# EAGLE schematic ME433 (EAGLE 7.5.0)
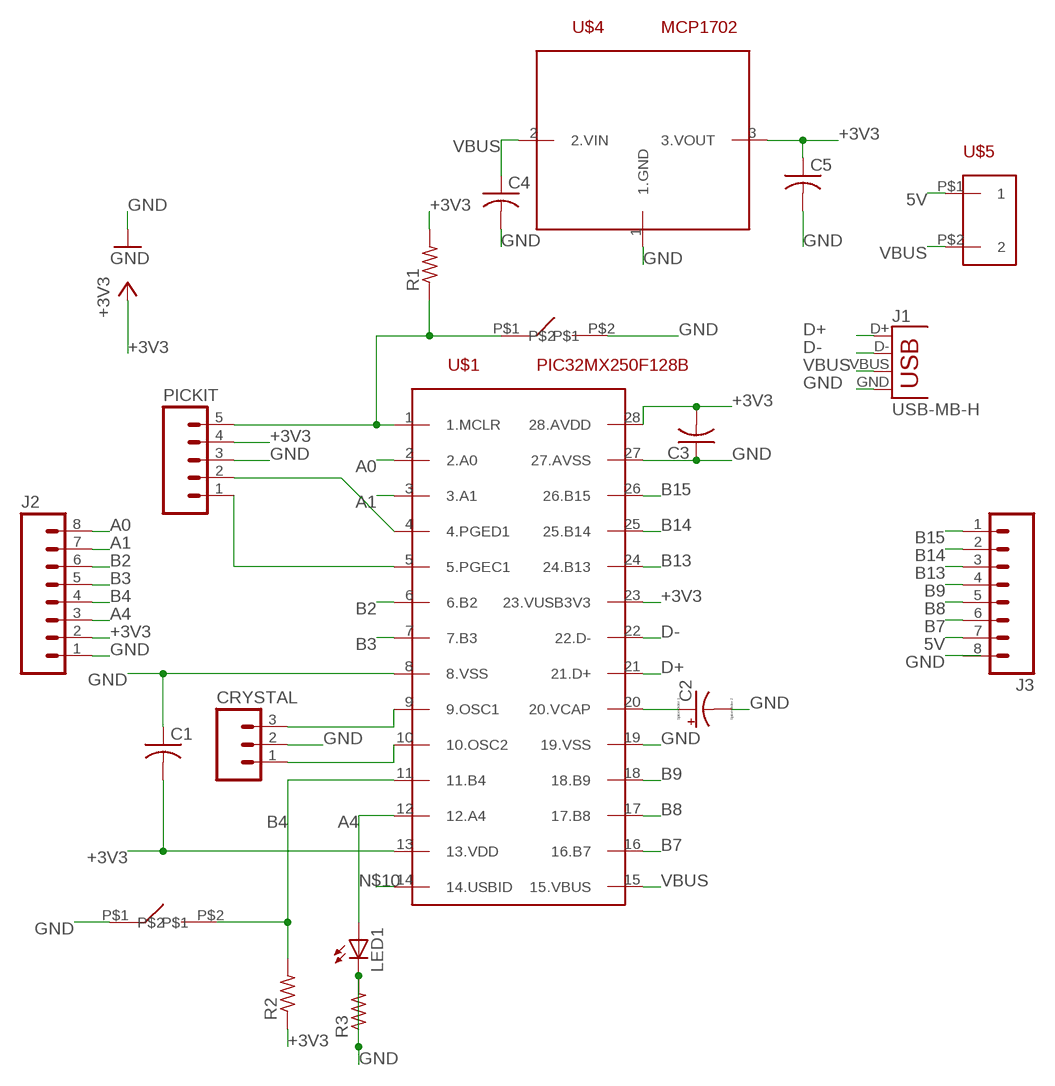
[diagram p0: schematic, sheet 1]

## Parts
C1  C-US025-025X050  [C025-025X050]
C2  CPOL-USE2,5-6E  [E2,5-6E]
C3  C-US025-025X050  [C025-025X050]
C4  C-US025-025X050  [C025-025X050]
C5  C-US025-025X050  [C025-025X050]
CRYSTAL  M03PTH  [1X03]
J1  USB-MB-H  [USB-MB-H]
J2  M08  [1X08_ROUND]
J3  M08  [1X08_ROUND]
LED1  LED3MM  [LED3MM]
PICKIT  M05PTH  [1X05]
R1  R-US_0207/10  [0207/10]
R2  R-US_0207/10  [0207/10]
R3  R-US_0207/10  [0207/10]
U$1  PIC32MX250F128B  [DIL28-3]
U$2  PUSHBUTTON  [PUSHBUTTON]
U$3  PUSHBUTTON  [PUSHBUTTON]
U$4  MCP1702  [TO92]
U$5  SLIDESWITCH  [SLIDESWITCH]

## Nets
5V: J3.7 U$5.P$1
+3V3: C1.2 C3.2 C5.1 J2.2 PICKIT.4 R1.2 R2.1 U$1.13(13.VDD) U$1.23(23.VUSB3V3) U$1.28(28.AVDD) U$4.3(3.VOUT)
A0: J2.8 U$1.2(2.A0)
A1: J2.7 U$1.3(3.A1)
A4: J2.3 LED1.A U$1.12(12.A4)
B2: J2.6 U$1.6(6.B2)
B3: J2.5 U$1.7(7.B3)
B4: J2.4 R2.2 U$1.11(11.B4) U$3.P$2
B7: J3.6 U$1.16(16.B7)
B8: J3.5 U$1.17(17.B8)
B9: J3.4 U$1.18(18.B9)
B13: J3.3 U$1.24(24.B13)
B14: J3.2 U$1.25(25.B14)
B15: J3.1 U$1.26(26.B15)
D+: J1.D+ U$1.21(21.D+)
D-: J1.D- U$1.22(22.D-)
GND: C1.1 C2.+ C2.- C3.1 C4.2 C5.2 CRYSTAL.2 J1.GND J2.1 LED1.K(C) PICKIT.3 R3.1 R3.2 U$1.8(8.VSS) U$1.19(19.VSS) U$1.20(20.VCAP) U$1.27(27.AVSS) U$2.P$2 U$3.P$1 U$4.1(1.GND)
MCLR: PICKIT.5 R1.1 U$1.1(1.MCLR) U$2.P$1
N$1: CRYSTAL.3 U$1.9(9.OSC1)
N$6: CRYSTAL.1 U$1.10(10.OSC2)
N$10: U$1.14(14.USBID)
PGC: PICKIT.1 U$1.5(5.PGEC1)
PGD: PICKIT.2 U$1.4(4.PGED1)
VBUS: C4.1 J1.VBUS U$1.15(15.VBUS) U$4.2(2.VIN) U$5.P$2
Unconnected: J3.8

## Library data of the parts
C1 C3-C5 = ME433:C-US: CAPACITOR, American symbol
C2 = ME433:CPOL-US: POLARIZED CAPACITOR, American symbol
CRYSTAL = ME433:M03: Header 3 Standard 3-pin 0.1" header. Use with straight break away headers (SKU : PRT-00116), right angle break away headers (PRT-00553), swiss pins (PRT-00743), machine pins (PRT-00117), and female headers (PRT-00115). Molex polarized connector foot print use with SKU : PRT-08232 with associated crimp pins and housings.
J1 = ME433:USB: USB Connectors USB-B-PTH is fully proven SKU : PRT-00139/CONN-08278 USB-miniB is fully proven SKU : PRT-00587 USB-A-PCB is untested. USB-A-H is throughly reviewed, but untested. Spark Fun Electronics SKU : PRT-00437 USB-B-SMT is throughly reviewed, but untested. Needs silkscreen touching up. USB-A-S has not been used/tested USB-MB-H has not been used/tested USB-MICROB has been used. CONN-09505
J2 J3 = ME433:M08: Header 8 Standard 8-pin 0.1" header. Use with straight break away headers (SKU : PRT-00116), right angle break away headers (PRT-00553), swiss pins (PRT-00743), machine pins (PRT-00117), and female headers (PRT-00115).; PROD_ID: CONN-08437
LED1 = ME433:LED: LED OSRAM: - CHIPLED LG R971, LG N971, LY N971, LG Q971, LY Q971, LO R971, LY R971 LH N974, LH R974 LS Q976, LO Q976, LY Q976 LO Q996 - Hyper CHIPLED LW Q18S LB Q993, LB Q99A, LB R99A - SideLED LS A670, LO A670, LY A670, LG A670, LP A670 LB A673, LV A673, LT A673, LW A673 LH A674 LY A675 LS A676, LA A676, LO A676, LY A676, LW A676 LS A679, LY A679, LG A679 - Hyper Micro SIDELED® LS Y876, LA Y876, LO Y876, LY Y876 LT Y87S - SmartLED LW L88C, LW L88S LB L89C, LB L89S, LG L890 LS L89K, LO L89K, LY L89K LS L896, LA L896, LO L896, LY L896 - TOPLED LS T670, LO T670, LY T670, LG T670, LP T670 LSG T670, LSP T670, LSY T670, LOP T670, LYG T670 LG T671, LOG T671, LSG T671 LB T673, LV T673, LT T673, LW T673 LH T674 LS T676, LA T676, LO T676, LY T676, LB T676, LH T676, LSB T676, LW T676 LB T67C, LV T67C, LT T67C, LS T67K, LO T67K, LY T67K, LW E67C LS E67B, LA E67B, LO E67B, LY E67B, LB E67C, LV E67C, LT E67C LW T67C LS T679, LY T679, LG T679 LS T770, LO T770, LY T770, LG T770, LP T770 LB T773, LV T773, LT T773, LW T773 LH T774 LS E675, LA E675, LY E675, LS T675 LS T776, LA T776, LO T776, LY T776, LB T776 LHGB T686 LT T68C, LB T68C - Hyper Mini TOPLED® LB M676 - Mini TOPLED Santana® LG M470 LS M47K, LO M47K, LY M47K Source: http://www.osram.convergy.de LUXEON: - LUMILED® LXK2-PW12-R00, LXK2-PW12-S00, LXK2-PW14-U00, LXK2-PW14-V00 LXK2-PM12-R00, LXK2-PM12-S00, LXK2-PM14-U00 LXK2-PE12-Q00, LXK2-PE12-R00, LXK2-PE12-S00, LXK2-PE14-T00, LXK2-PE14-U00 LXK2-PB12-K00, LXK2-PB12-L00, LXK2-PB12-M00, LXK2-PB14-N00, LXK2-PB14-P00, LXK2-PB14-Q00 LXK2-PR12-L00, LXK2-PR12-M00, LXK2-PR14-Q00, LXK2-PR14-R00 LXK2-PD12-Q00, LXK2-PD12-R00, LXK2-PD12-S00 LXK2-PH12-R00, LXK2-PH12-S00 LXK2-PL12-P00, LXK2-PL12-Q00, LXK2-PL12-R00 Source: www.luxeon.com KINGBRIGHT: KA-3528ASYC Source: www.kingbright.com
PICKIT = ME433:M05: Header 5 Standard 5-pin 0.1" header. Use with straight break away headers (SKU : PRT-00116), right angle break away headers (PRT-00553), swiss pins (PRT-00743), machine pins (PRT-00117), and female headers (PRT-00115). Molex polarized connector foot print use with SKU : PRT-08230 with associated crimp pins and housings.
R1-R3 = ME433:R-US_: RESISTOR, American symbol
U$1 = ME433:PIC32MX250F128B
U$2 U$3 = ME433:PUSHBUTTON
U$4 = ME433:MCP1702
U$5 = ME433:SLIDESWITCH